# EAGLE design lightampSMT (EAGLE 9.5.1)
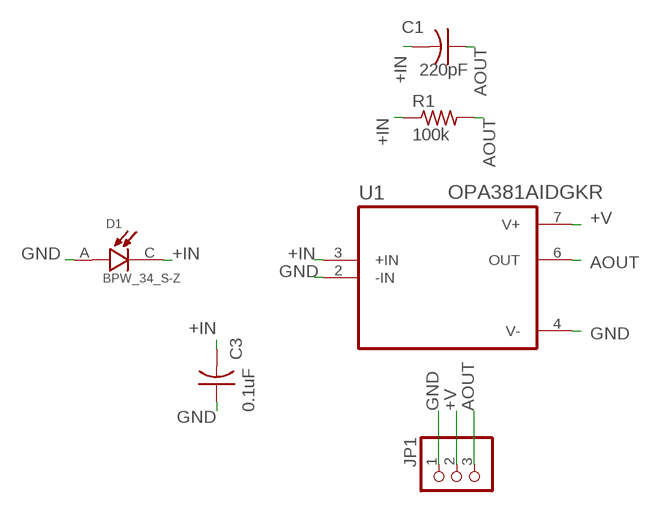
[diagram p0: schematic, sheet 1]

## Parts
C1  220pF  C-USC0603K  [C0603K]
C3  0.1uF  C-USC0603K  [C0603K]
D1  BPW_34_S-Z  [DIO_BPW_34_S-Z]
JP1  PINHD-1X3  [1X03]
R1  100k  R-US_R0603  [R0603]
U1  OPA381AIDGKR  [SOP65P490X110-8N]

## Nets
+IN: C1.2 C3.2 D1.C R1.1 U1.3(+IN)
+V: JP1.2 U1.7(V+)
AOUT: C1.1 JP1.3 R1.2 U1.6(OUT)
GND: C3.1 D1.A JP1.1 U1.2(-IN) U1.4(V-)

## Library data of the parts
C1 C3 = adafruit:C-US: CAPACITOR, American symbol
D1 = BPW_34_S-Z:BPW_34_S-Z: Silicon PIN Photodiode Check availability <https://pricing.snapeda.com/parts/BPW%2034%20S-Z/OSRAM%20Opto/view-part?ref=eda>; AVAILABILITY: In Stock; DESCRIPTION: Photodiode 850nm 20ns 120° 2-SMD, Gull Wing; MF: OSRAM Opto; MP: BPW 34 S-Z; PACKAGE: SMD-2 OSRAM Opto Semiconductors; PRICE: None; PURCHASE-URL: https://pricing.snapeda.com/search/part/BPW 34 S-Z/?ref=eda
JP1 = adafruit:PINHD-1X3: PIN HEADER
R1 = adafruit:R-US_: RESISTOR, American symbol
U1 = OPA381AIDGKR:OPA381AIDGKR: Check availability <https://pricing.snapeda.com/parts/OPA381AIDGKR/Texas%20Instruments/view-part?ref=eda>; AVAILABILITY: In Stock; DESCRIPTION: Precision, Low Power, High-Speed Transimpedance Amplifier 8-VSSOP -40 to 125; MF: Texas Instruments; MP: OPA381AIDGKR; PACKAGE: VSSOP-8 Texas Instruments; PRICE: None; PURCHASE-URL: https://pricing.snapeda.com/search/part/OPA381AIDGKR/?ref=eda

## Board
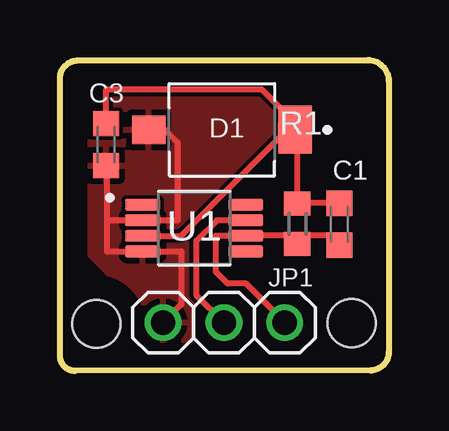
[diagram p1: board, top side]
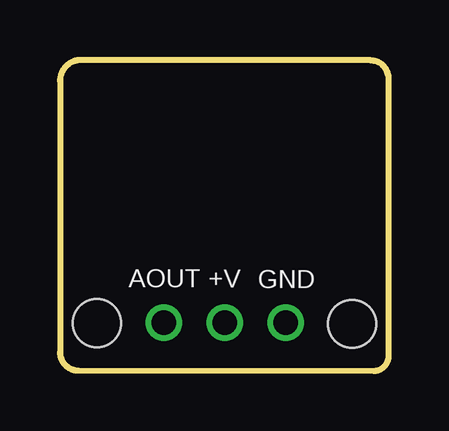
[diagram p2: board, bottom side, seen from below]

Size 13.71 x 12.97 mm. Coordinates in mm from the lower left corner, seen from the top.
Outline: 12.95,0.02 0.64,0 arc-90 0,0.63 0,12.19 arc-90 0.76,12.95 12.82,12.97 arc-90 13.71,12.08 13.71,0.78 arc-90 12.95,0.02
Copper layers (1*16): Top 0.035mm / dielectric 1.5mm / Bottom 0.035mm
Design rules "default": minimum track width 6mil, minimum drill 0.35mm, track to track 6mil, track to pad 6mil, pad to pad 6mil, via to via 6mil, smd to smd 6mil, copper to edge 40mil, drill to drill 6mil, minimum pad ring 10mil, minimum via ring 8mil, stop-mask expansion 4mil, vias tented up to drill 0mil, thermal gap 10mil
Holes 2 mm at 1.52,1.97 12.17,1.99

### Footprints (pad centres in the part's own frame; a part is rotated, then mirrored left to right if it is on the bottom)
C0603K = smd 1.05 x 1.08: 1 -0.875,0; 2 0.875,0
DIO_BPW_34_S-Z = smd 1.4 x 1.2: A -3.05,0 | smd 1.4 x 2: C 3.05,0
1X03 = drill 1.016: 1 -2.54,0; 2 0,0; 3 2.54,0
R0603 = smd 1 x 1.1: 1 -0.85,0; 2 0.85,0
SOP65P490X110-8N = smd 1.47 x 0.48: 1 -2.15,0.975; 2 -2.15,0.325; 3 -2.15,-0.325; 4 -2.15,-0.975; 5 2.15,-0.975; 6 2.15,-0.325; 7 2.15,0.325; 8 2.15,0.975

### Placement (x,y rotation side)
C1  11.65,6.12 90 top
C3  1.93,9.44 90 top
D1  6.76,10.06 0 top
JP1  6.84,2.02 0 top
R1  9.9,6.14 270 top
U1  5.6,5.96 0 top

### Tracks (layer width: path | path; a pad name or v marks a point on that pad's centre or on a via)
+IN
  Top 0.254: U1.3 5.06,5.64 9.22,9.8 9.22,10.36 D1.C | C3.2 1.93,11.74 8.43,11.74 9.55,10.61 D1.C | D1.C 9.9,9.94 R1.1 9.9,7.01 C1.2
+V
  Top 0.254: U1.7 6.55,6.29 5.69,5.42 5.69,3.17 JP1.2
AOUT
  Top 0.254: C1.1 11.65,5.65 9.9,5.65 R1.2 9.55,5.65 U1.6 6.49,5.64 6.49,4.14 7,3.64 7.76,3.64 JP1.3
GND
  Top 0.254: D1.A 4.21,10.24 4.91,9.54 4.91,6.29 U1.2 1.95,6.29 | C3.1 1.95,8.55 1.95,6.29 | JP1.1 5.06,2.77 5.06,4.99 U1.4 1.95,4.99 1.95,6.29
  pour Top: 0.94,5.16 3,3.1 3,1.42 3.71,0.71 4.88,0.71 5.54,1.37 5.54,2.62 6.83,3.91 12.24,3.91 13.08,4.75 13.08,12.34 0.94,12.34

### Text on the board
bPlace: GND | +V | AOUT